# Altium schematic sheet 总图.SchDoc: 分区电源管理电路板-总图
size A4; Date: 2019-4-24; ApprovedBy: 杨青; CheckedBy: 杨青; DrawnBy: 杨青; Engineer: 杨青; Organization: 智能实训室产品部; DocumentNumber: 190416; Revision: V1.0; SheetNumber: 6; SheetTotal: 6; ProjectName_GTA: 实训室智能化管理系统; PCB Number: GS-P1B-GXO02
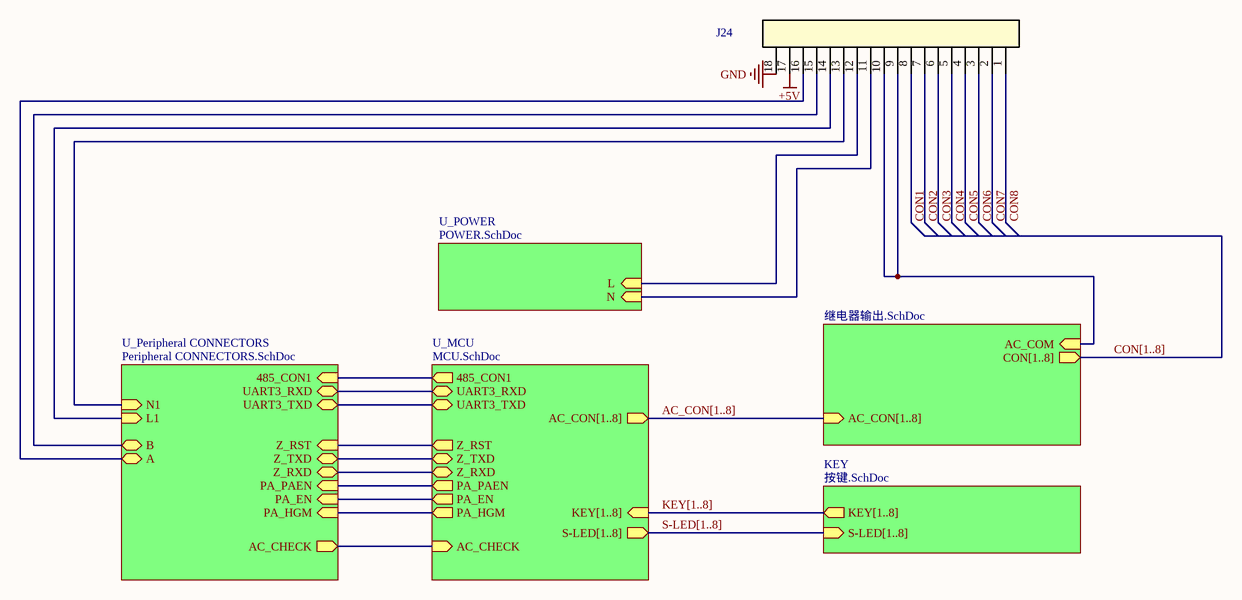
[diagram p0: 总图.SchDoc]

## Parts
J24  KF2EDGK5.08-18P  [KF2EDGKG5.08-18P]  (value not drawn)

## Sub-sheets
KEY = 按键.SchDoc: KEY[1..8] (out), S-LED[1..8] (in)
U_MCU = MCU.SchDoc: 485_CON1 (out), UART3_RXD (bidir), UART3_TXD (bidir), Z_RST (out), Z_TXD (bidir), Z_RXD (bidir), AC_CHECK (in), AC_CON[1..8] (out), KEY[1..8] (in), S-LED[1..8] (out), PA_PAEN (out), PA_EN (out), PA_HGM (out)
U_Peripheral CONNECTORS = Peripheral CONNECTORS.SchDoc: 485_CON1 (in), Z_TXD (bidir), Z_RXD (bidir), Z_RST (in), UART3_RXD (bidir), UART3_TXD (bidir), AC_CHECK (out), B (bidir), A (bidir), N1 (in), L1 (in), PA_PAEN (in), PA_EN (in), PA_HGM (in)
U_POWER = POWER.SchDoc: L (in), N (in)
? = 继电器输出.SchDoc: AC_CON[1..8] (in), CON[1..8] (out), AC_COM (in)

## Nets
+5V: J24.17
GND: J24.18
CON1: J24.8
CON2: J24.7
CON3: J24.6
CON4: J24.5
CON5: J24.4
CON6: J24.3
CON7: J24.2
CON8: J24.1
NetJ24_9: J24.9 J24.10 ; sheet /AC_COM
NetJ24_11: J24.11 ; sheet U_POWER/N
NetJ24_12: J24.12 ; sheet U_POWER/L
NetJ24_13: J24.13 ; sheet U_Peripheral CONNECTORS/N1
NetJ24_14: J24.14 ; sheet U_Peripheral CONNECTORS/L1
NetJ24_15: J24.15 ; sheet U_Peripheral CONNECTORS/B
NetJ24_16: J24.16 ; sheet U_Peripheral CONNECTORS/A
(unnamed): sheet U_MCU/485_CON1, sheet U_Peripheral CONNECTORS/485_CON1
(unnamed): sheet U_MCU/UART3_RXD, sheet U_Peripheral CONNECTORS/UART3_RXD
(unnamed): sheet U_MCU/UART3_TXD, sheet U_Peripheral CONNECTORS/UART3_TXD
(unnamed): sheet U_MCU/Z_RST, sheet U_Peripheral CONNECTORS/Z_RST
(unnamed): sheet U_MCU/Z_TXD, sheet U_Peripheral CONNECTORS/Z_TXD
(unnamed): sheet U_MCU/Z_RXD, sheet U_Peripheral CONNECTORS/Z_RXD
(unnamed): sheet U_MCU/AC_CHECK, sheet U_Peripheral CONNECTORS/AC_CHECK
(unnamed): sheet U_MCU/PA_PAEN, sheet U_Peripheral CONNECTORS/PA_PAEN
(unnamed): sheet U_MCU/PA_EN, sheet U_Peripheral CONNECTORS/PA_EN
(unnamed): sheet U_MCU/PA_HGM, sheet U_Peripheral CONNECTORS/PA_HGM

## Buses and harness runs
bus AC_CON[1..8] = sheet /AC_CON[1..8] = sheet U_MCU/AC_CON[1..8]
bus CON[1..8] = sheet /CON[1..8]
bus KEY[1..8] = sheet KEY/KEY[1..8] = sheet U_MCU/KEY[1..8]
bus S-LED[1..8] = sheet KEY/S-LED[1..8] = sheet U_MCU/S-LED[1..8]

## Notes on the sheet
- 纸张:
- 项目:
- A4
- 编号:
- -
- 版本号:
- 图纸
- of
- 深圳市国顺教育科
- 技有限公司
- 设计:
- 绘图:
- 检查:
- 批准:
- 日期:

## Library data of the parts
J24 = KF2EDGK5.08-18P: KF2EDGK5.08; 规格/型号: KF2EDGK5.08,18P,西门子S7-200PLC接线端子; 物料名称: 接线端子; 单价: 10; 供应商: https://item.taobao.com/item.htm?spm=a1z0d.6639537.1997196601.555.1d577484fYqqSI&id=42101587513